# EAGLE design pizerohat (EAGLE 9.5.2)
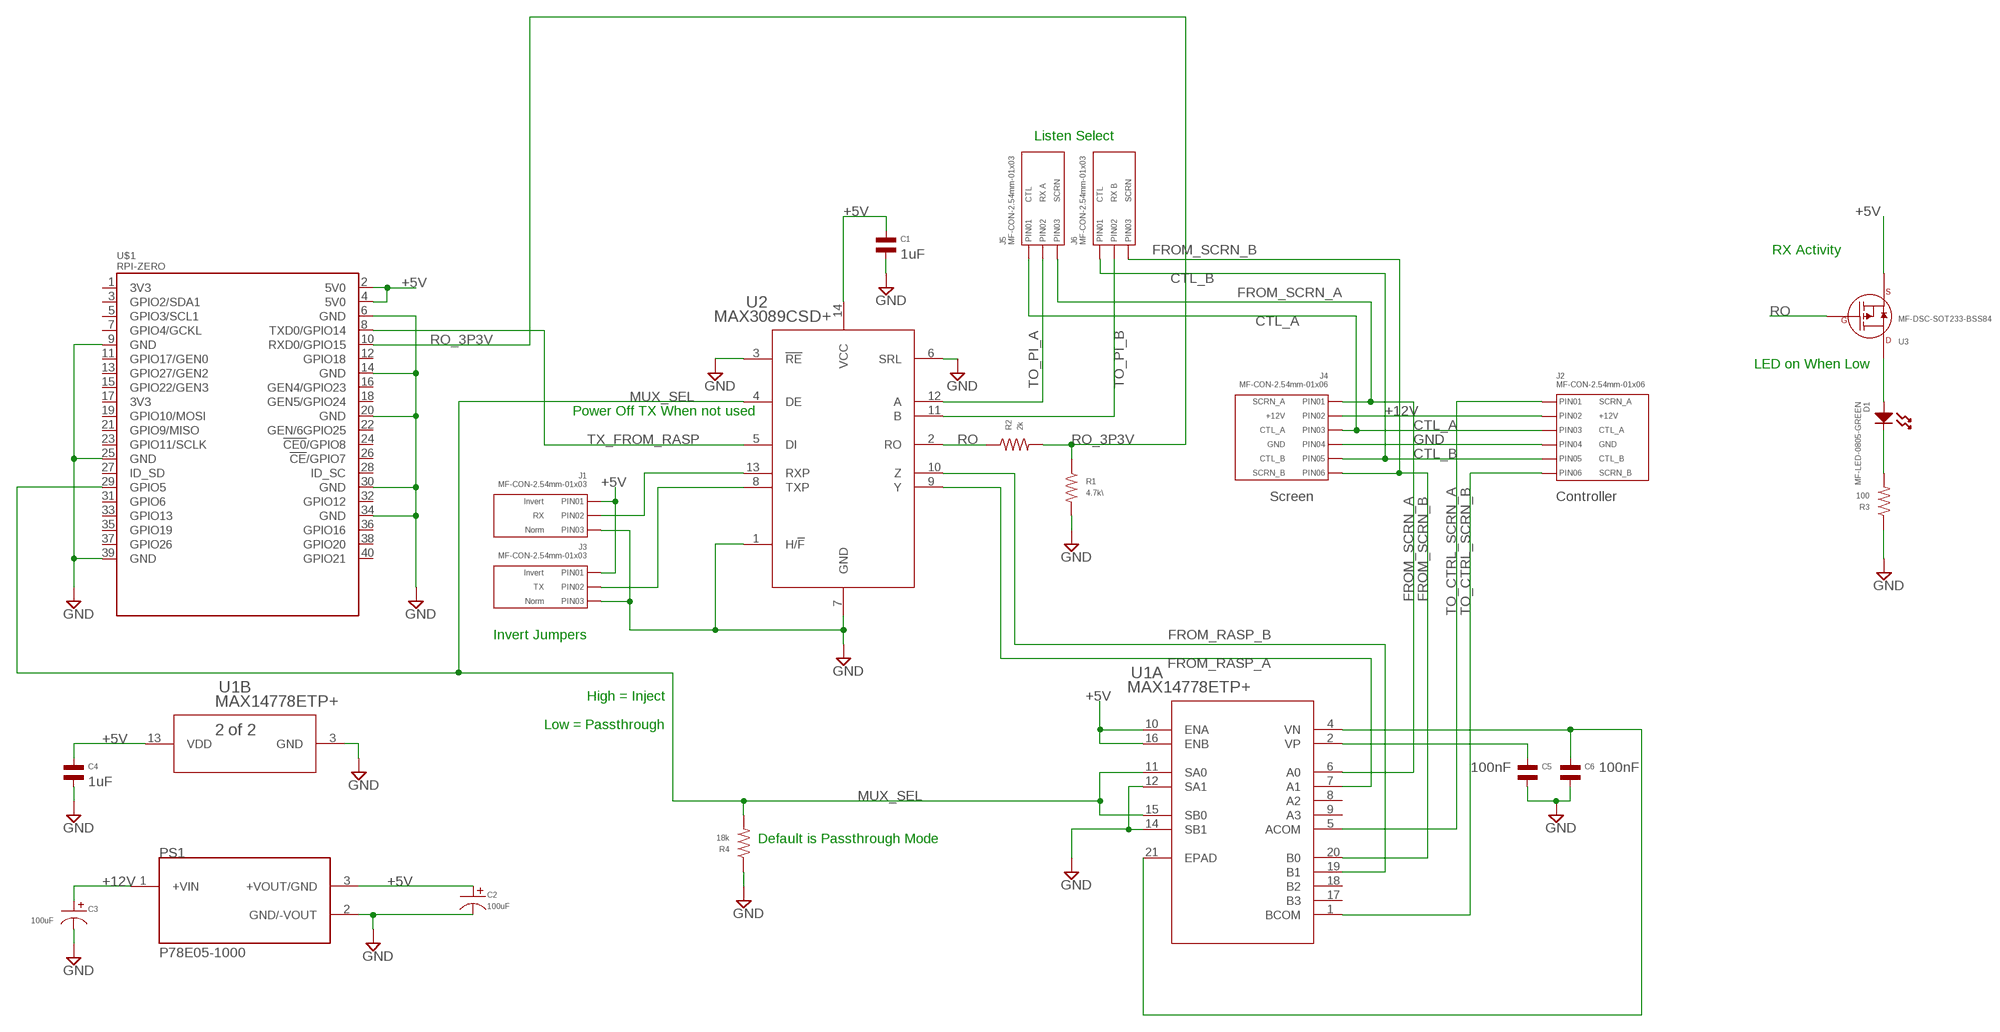
[diagram p0: schematic, sheet 1]

## Parts
C1  CAPACITOR_NP_0603  [C0603]
C2  100uF  CAPACITOR_P_6.3MM  [CP6.3MM]
C3  100uF  CAPACITOR_P_6.3MM  [CP6.3MM]
C4  CAPACITOR_NP_0603  [C0603]
C5  CAPACITOR_NP_0805  [C0805]
C6  CAPACITOR_NP_0805  [C0805]
D1  MF-LED-0805-GREEN  LED_SINGLE-0805-GREEN  [LED0805]
J1  MF-CON-2.54mm-01x03  CON_01X03_PTH_2.54MM  [PTH_2.54MM_01X03]
J2  MF-CON-2.54mm-01x06  CON_01X06_PTH_2.54MM  [PTH_2.54MM_01X06]
J3  MF-CON-2.54mm-01x03  CON_01X03_PTH_2.54MM  [PTH_2.54MM_01X03]
J4  MF-CON-2.54mm-01x06  CON_01X06_PTH_2.54MM  [PTH_2.54MM_01X06]
J5  MF-CON-2.54mm-01x03  CON_01X03_PTH_2.54MM  [PTH_2.54MM_01X03]
J6  MF-CON-2.54mm-01x03  CON_01X03_PTH_2.54MM  [PTH_2.54MM_01X03]
PS1  P78E05-1000  [CONV_P78E05-1000]
R1  4.7k\  RESISTOR_0603  [R0603]
R2  2k  RESISTOR_0603  [R0603]
R3  100  RESISTOR_0603  [R0603]
R4  18k  RESISTOR_0603  [R0603]
U1  MAX14778ETP+  [21-0140L_T2055-4]
U2  MAX3089CSD+  [21-0041B_14]
U3  MF-DSC-SOT233-BSS84  P-CHANNEL_FET_BSS84_SOT-23-3  [SOT-23-3]
U$1  RPI-ZERO  [RASPBERRYPI_BASTELSTUBE_V13_RASPI_BOARD_B+_FULL]

## Nets
+5V: C1.P$1 C2.P$1 C4.P$1 J1.P$1(PIN1) J3.P$1(PIN1) PS1.3(+VOUT/GND) U1.10(A:ENA) U1.13(B:VDD) U1.16(A:ENB) U2.14(VCC) U3.P$2(SOURCE) U$1.2(5V0) U$1.4(5V0)
+12V: C3.P$1 J2.P$2(PIN2) J4.P$2(PIN2) PS1.1(+VIN)
CTL_A: J2.P$3(PIN3) J4.P$3(PIN3) J5.P$1(PIN1)
CTL_B: J2.P$5(PIN5) J4.P$5(PIN5) J6.P$1(PIN1)
FROM_RASP_A: U1.7(A:A1) U2.9(Y)
FROM_RASP_B: U1.19(A:B1) U2.10(Z)
FROM_SCRN_A: J4.P$1(PIN1) J5.P$3(PIN3) U1.6(A:A0)
FROM_SCRN_B: J4.P$6(PIN6) J6.P$3(PIN3) U1.20(A:B0)
GND: C1.P$2 C2.P$2 C3.P$2 C4.P$2 C5.P$2 C6.P$2 J1.P$3(PIN3) J2.P$4(PIN4) J3.P$3(PIN3) J4.P$4(PIN4) PS1.2(GND/-VOUT) R1.P$2 R3.P$1 R4.P$1 U1.3(B:GND) U1.12(A:SA1) U1.14(A:SB1) U2.1(H/!F) U2.3(!RE) U2.6(SRL) U2.7(GND) U$1.6(GND) U$1.9(GND) U$1.14(GND) U$1.20(GND) U$1.25(GND) U$1.30(GND) U$1.34(GND) U$1.39(GND)
MUX_SEL: R4.P$2 U1.11(A:SA0) U1.15(A:SB0) U2.4(DE) U$1.29(GPIO5)
N$3: J1.P$2(PIN2) U2.13(RXP)
N$4: J3.P$2(PIN2) U2.8(TXP)
N$5: C6.P$1 U1.4(A:VN) U1.21(A:EPAD)
N$6: D1.CATHODE R3.P$2
N$7: C5.P$1 U1.2(A:VP)
N$9: D1.ANODE U3.P$3(DRAIN)
RO: R2.P$1 U2.2(RO) U3.P$1(GATE)
RO_3P3V: R1.P$1 R2.P$2 U$1.10(RXD0/GPIO15)
TO_CTRL_SCRN_A: J2.P$1(PIN1) U1.5(A:ACOM)
TO_CTRL_SCRN_B: J2.P$6(PIN6) U1.1(A:BCOM)
TO_PI_A: J5.P$2(PIN2) U2.12(A)
TO_PI_B: J6.P$2(PIN2) U2.11(B)
TX_FROM_RASP: U2.5(DI) U$1.8(TXD0/GPIO14)
Unconnected: U1.8(A:A2) U1.9(A:A3) U1.17(A:B3) U1.18(A:B2) U$1.1(3V3) U$1.3(GPIO2/SDA1) U$1.5(GPIO3/SCL1) U$1.7(GPIO4/GCKL) U$1.11(GPIO17/GEN0) U$1.12(GPIO18) U$1.13(GPIO27/GEN2) U$1.15(GPIO22/GEN3) U$1.16(GEN4/GPIO23) U$1.17(3V3) U$1.18(GEN5/GPIO24) U$1.19(GPIO10/MOSI) U$1.21(GPIO9/MISO) U$1.22(GEN/6GPIO25) U$1.23(GPIO11/SCLK) U$1.24(!CE0!/GPIO8) U$1.26(!CE!/GPIO7) U$1.27(ID_SD) U$1.28(ID_SC) U$1.31(GPIO6) U$1.32(GPIO12) U$1.33(GPIO13) U$1.35(GPIO19) U$1.36(GPIO16) U$1.37(GPIO26) U$1.38(GPIO20) U$1.40(GPIO21)

## Notes on the sheet
- Listen Select
- RX Activity
- LED on When Low
- Power Off TX When not used
- Invert Jumpers
- High = Inject
- Low = Passthrough
- Default is Passthrough Mode

## Library data of the parts
C1 C4 = MF_Passives:CAPACITOR_NP: Library: MF_Passives Description: Device for Non-Polarized Capacitors. Manufacture part number (MPN) can be added via Attributes. Check https://factory.macrofab.com/parts for the house parts list.; CAP: 1uF; HOUSEPART: Y; MPN: MF-CAP-0603-1uF; POPULATE: 1
C2 C3 = MF_Passives:CAPACITOR_P: Library: MF_Passives Description: Device for Polarized Capacitors. Manufacture part number (MPN), Voltage Rating, and Tolerance can be added via Attributes. Check https://factory.macrofab.com/parts for the house parts list.; HOUSEPART: Y; MPN: MF-CAP-6.3MM-100uF; POPULATE: 1
C5 C6 = MF_Passives:CAPACITOR_NP: Library: MF_Passives Description: Device for Non-Polarized Capacitors. Manufacture part number (MPN) can be added via Attributes. Check https://factory.macrofab.com/parts for the house parts list.; CAP: 100nF; HOUSEPART: Y; MPN: MF-CAP-0805-0.1uF; POPULATE: 1
D1 = MF_LEDs:LED_SINGLE: Library: MF_LEDs Description: Device for Single LED Packages. Manufacture part number (MFG#) can be added via Attributes.; HOUSEPART: YES; MPN: MF-LED-0805-GREEN; POPULATE: 1; URL: https://factory.macrofab.com/part/MF-LED-0805-GREEN
J1 = MF_Connectors:CON_01X03: Library: MF_Connectors Description: Header Connector with 03 Positions and 01 Rows. Use the LABEL Attribute to label the pin on the schematic and PCB. You can remove the attributes on the PCB by using the SMASH function on the part and then deleting the text.; HOUSEPART: YES; LABEL01: Invert; LABEL02: RX; LABEL03: Norm; MPN: MF-CON-2.54mm-01x03; POPULATE: 1; URL: https://factory.macrofab.com/part/MF-CON-2.54mm-01x03
J2 = MF_Connectors:CON_01X06: Library: MF_Connectors Description: Header Connector with 6 Positions and 01 Rows. Use the LABEL Attribute to label the pin on the schematic and PCB. You can remove the attributes on the PCB by using the SMASH function on the part and then deleting the text.; HOUSEPART: YES; LABEL: Controller; LABEL01: SCRN_A; LABEL02: +12V; LABEL03: CTL_A; LABEL04: GND; LABEL05: CTL_B; LABEL06: SCRN_B; MPN: MF-CON-2.54mm-01x06; POPULATE: 1; URL: https://factory.macrofab.com/part/MF-CON-2.54mm-01x06
J3 = MF_Connectors:CON_01X03: Library: MF_Connectors Description: Header Connector with 03 Positions and 01 Rows. Use the LABEL Attribute to label the pin on the schematic and PCB. You can remove the attributes on the PCB by using the SMASH function on the part and then deleting the text.; HOUSEPART: YES; LABEL01: Invert; LABEL02: TX; LABEL03: Norm; MPN: MF-CON-2.54mm-01x03; POPULATE: 1; URL: https://factory.macrofab.com/part/MF-CON-2.54mm-01x03
J4 = MF_Connectors:CON_01X06: Library: MF_Connectors Description: Header Connector with 6 Positions and 01 Rows. Use the LABEL Attribute to label the pin on the schematic and PCB. You can remove the attributes on the PCB by using the SMASH function on the part and then deleting the text.; HOUSEPART: YES; LABEL: Screen; LABEL01: SCRN_A; LABEL02: +12V; LABEL03: CTL_A; LABEL04: GND; LABEL05: CTL_B; LABEL06: SCRN_B; MPN: MF-CON-2.54mm-01x06; POPULATE: 1; URL: https://factory.macrofab.com/part/MF-CON-2.54mm-01x06
J5 = MF_Connectors:CON_01X03: Library: MF_Connectors Description: Header Connector with 03 Positions and 01 Rows. Use the LABEL Attribute to label the pin on the schematic and PCB. You can remove the attributes on the PCB by using the SMASH function on the part and then deleting the text.; HOUSEPART: YES; LABEL01: CTL; LABEL02: RX A; LABEL03: SCRN; MPN: MF-CON-2.54mm-01x03; POPULATE: 1; URL: https://factory.macrofab.com/part/MF-CON-2.54mm-01x03
J6 = MF_Connectors:CON_01X03: Library: MF_Connectors Description: Header Connector with 03 Positions and 01 Rows. Use the LABEL Attribute to label the pin on the schematic and PCB. You can remove the attributes on the PCB by using the SMASH function on the part and then deleting the text.; HOUSEPART: YES; LABEL01: CTL; LABEL02: RX B; LABEL03: SCRN; MPN: MF-CON-2.54mm-01x03; POPULATE: 1; URL: https://factory.macrofab.com/part/MF-CON-2.54mm-01x03
PS1 = P78E05-1000:P78E05-1000: NON-ISOLATED DC SWITCHING REGULATOR; CUI_PURCHASE_URL: https://www.cui.com/product/dc-dc-converters/non-isolated/p78e-1000-series?utm_source=snapeda.com&utm_medium=referral&utm_campaign=snapedaBOM; DESCRIPTION: 1 A Output Current, 6~36 Vdc Input, 3 Pin SIP, Non-Isolated, Dc-Dc Converter; DIGI-KEY_PART_NUMBER: 102-5018-ND; DIGI-KEY_PURCHASE_URL: https://www.digikey.com/product-detail/en/cui-inc/P78E05-1000/102-5018-ND/9649654?utm_source=snapeda&utm_medium=aggregator&utm_campaign=symbol; MF: CUI Inc.; MP: P78E05-1000; MPN: P78E05-1000; PACKAGE: SIP-3 CUI Inc.
R1 = MF_Passives:RESISTOR: Library: MF_Passives Description: Device for Resistors. Manufacture part number (MPN), Voltage, Tolerance, and Wattage Rating can be added via Attributes. Check https://factory.macrofab.com/parts for the house parts list.; HOUSEPART: YES; MPN: MF-RES-0603-4.7K; POPULATE: 1
R2 = MF_Passives:RESISTOR: Library: MF_Passives Description: Device for Resistors. Manufacture part number (MPN), Voltage, Tolerance, and Wattage Rating can be added via Attributes. Check https://factory.macrofab.com/parts for the house parts list.; HOUSEPART: YES; MPN: MF-RES-0603-2K; POPULATE: 1
R3 = MF_Passives:RESISTOR: Library: MF_Passives Description: Device for Resistors. Manufacture part number (MPN), Voltage, Tolerance, and Wattage Rating can be added via Attributes. Check https://factory.macrofab.com/parts for the house parts list.; HOUSEPART: YES; MPN: MF-RES-0603-100; POPULATE: 1
R4 = MF_Passives:RESISTOR: Library: MF_Passives Description: Device for Resistors. Manufacture part number (MPN), Voltage, Tolerance, and Wattage Rating can be added via Attributes. Check https://factory.macrofab.com/parts for the house parts list.; HOUSEPART: YES; MPN: MF-RES-0603-18K; POPULATE: 1
U1 = MAX3089:MAX14778ETP+; BUILT_BY: EMA_UL_Team; MANUFACTURER_PART_NUMBER: MAX14778ETP+; MPN: MAX14778ETP+; VENDOR: Maxim Integrated Products
U2 = MAX3089:MAX3089CSD+; BUILT_BY: EMA_UL_Team; MANUFACTURER_PART_NUMBER: MAX3089CSD+; MPN: MAX3089CSD+; VENDOR: Maxim Integrated Products
U3 = MF_Discrete_Semiconductor:P-CHANNEL_FET: Library: MF_Discrete_Semiconductor Description: Device for Single P-Channel Mosfet. Manufacture part number (MFG#) can be added via Attributes.; HOUSEPART: YES; LABEL: RX; MPN: MF-DSC-SOT233-BSS84; POPULATE: 1; URL: https://factory.macrofab.com/part/MF-DSC-SOT233-BSS84
U$1 = RPI-Zero:RPI-ZERO; POPULATE: 0

## Board
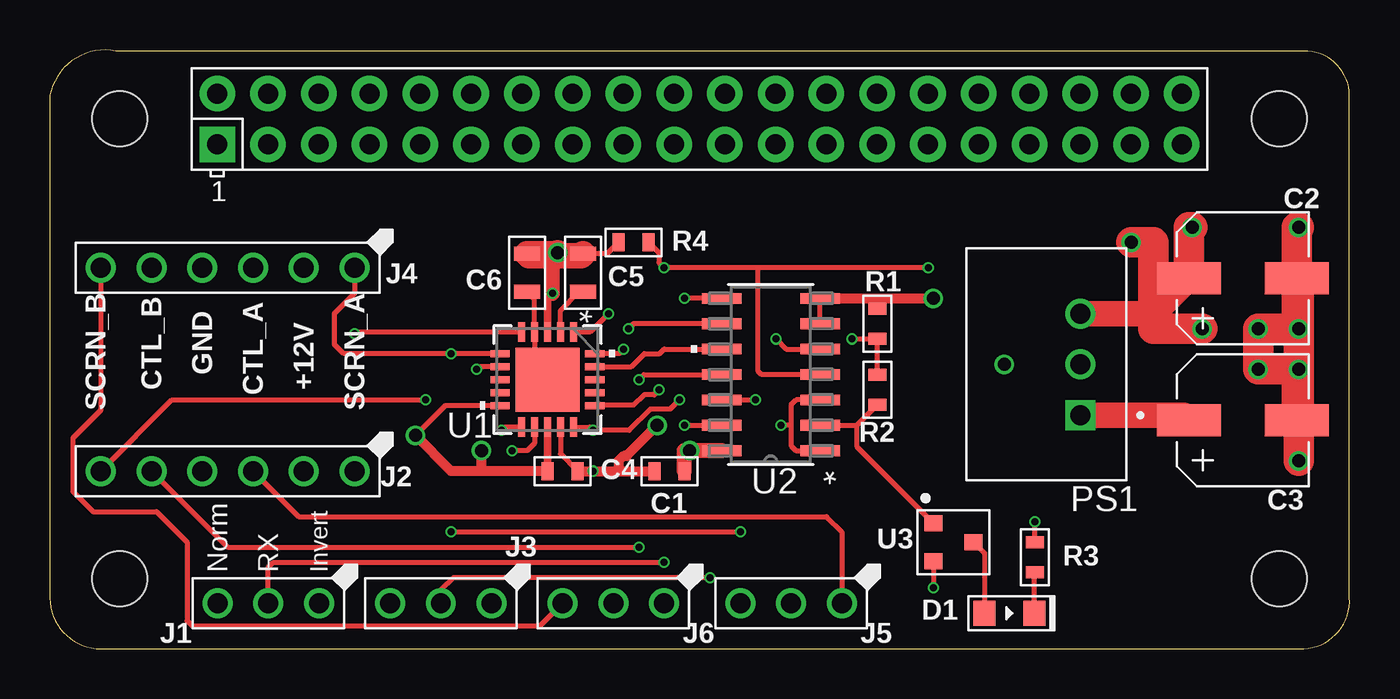
[diagram p1: board, top side]
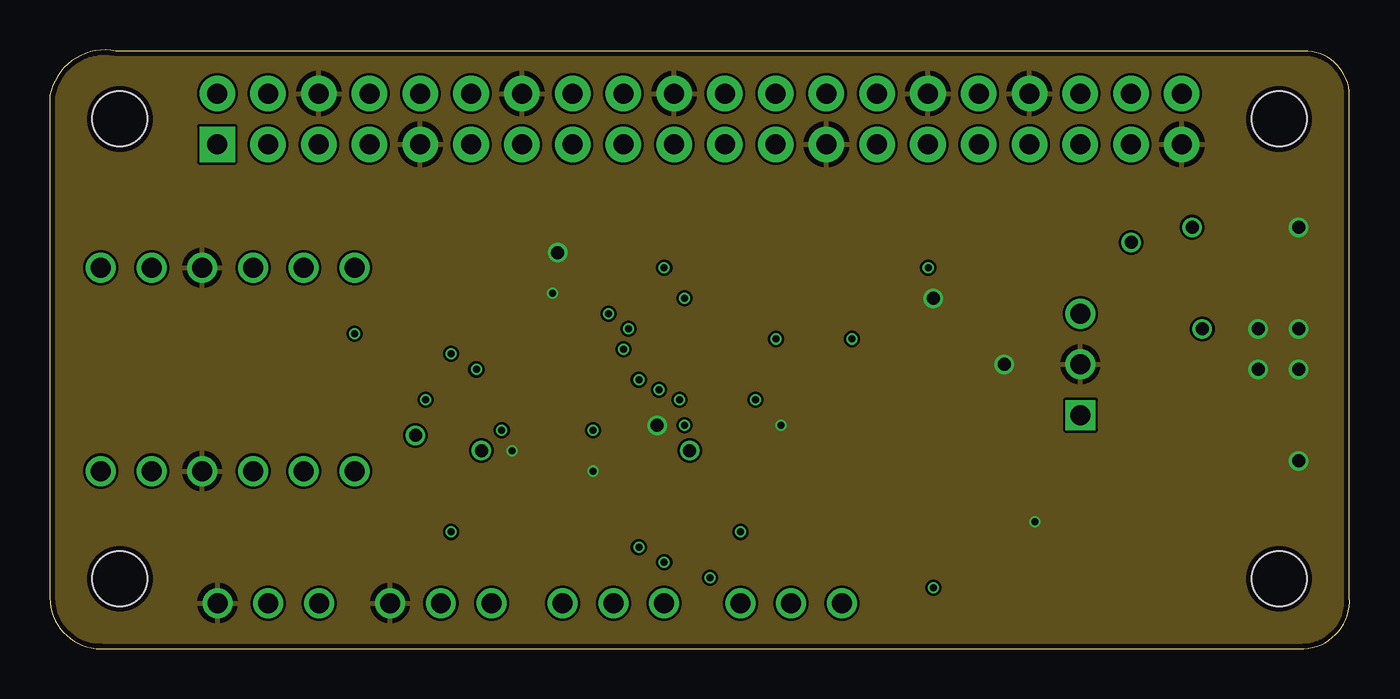
[diagram p2: board, inner layer Route2]
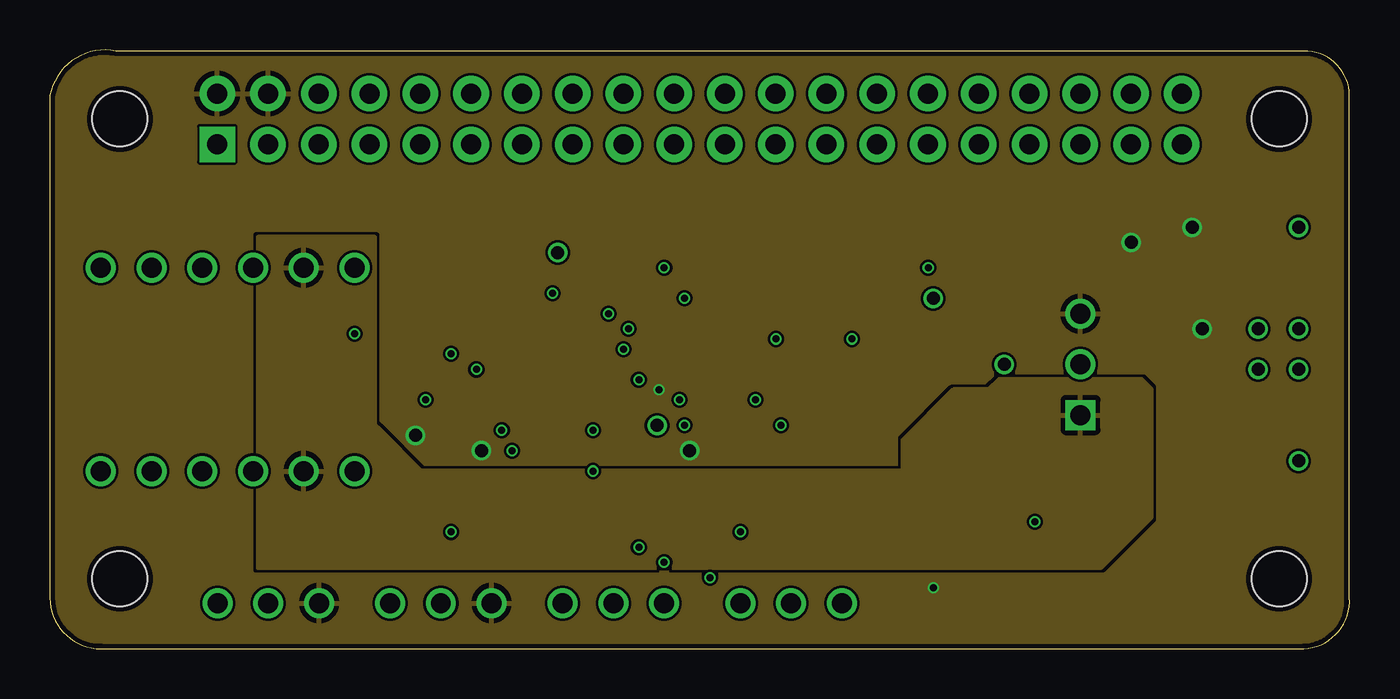
[diagram p3: board, inner layer Route15]
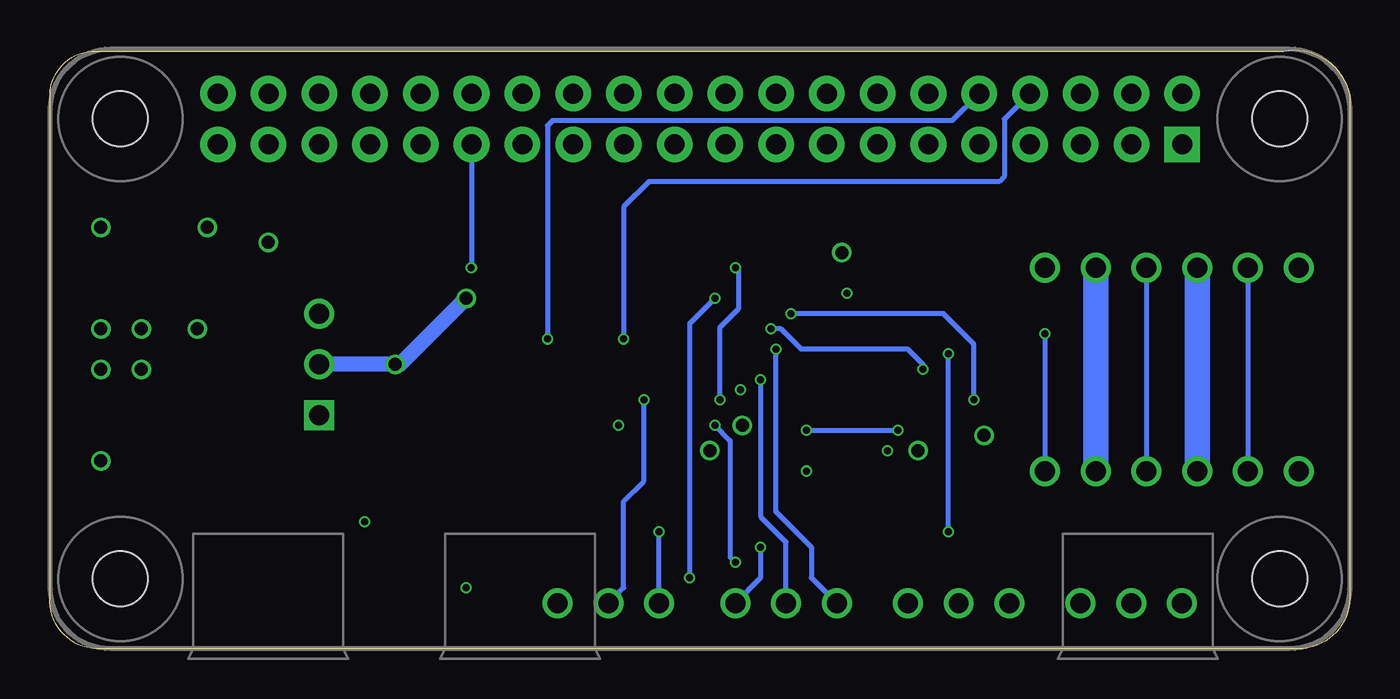
[diagram p4: board, bottom side, seen from below]

Size 65.03 x 29.95 mm. Coordinates in mm from the lower left corner, seen from the top.
Outline: 65.02,2.54 65.02,27.69 arc90 62.74,29.9 3.3,29.9 arc90 0,27.69 0,2.54 arc90 2.54,0 62.74,0 arc90 65.02,2.54
Copper layers (1*2*15*16): Top 0.035mm / dielectric 0.23mm / Route2 0.035mm / dielectric 0.93mm / Route15 0.035mm / dielectric 0.23mm / Bottom 0.035mm
Design rules "MF_Standard_4_Layer": minimum track width 5mil, minimum drill 10mil, track to track 5mil, track to pad 5mil, pad to pad 5mil, via to via 5mil, smd to smd 0mil, copper to edge 10mil, drill to drill 10mil, minimum pad ring 4mil, minimum via ring 4mil, stop-mask expansion 2mil, vias tented up to drill 25mil, thermal gap 10mil

### Footprints (pad centres in the part's own frame; a part is rotated, then mirrored left to right if it is on the bottom)
C0603 = smd 0.6 x 0.9: P$1 -0.75,0; P$2 0.75,0
CP6.3MM = smd 1.6 x 3.2: P$1 0,-2.7; P$2 0,2.7
C0805 = smd 0.7 x 1.3: P$1 -0.95,0; P$2 0.95,0
LED0805 = smd 1.1 x 1.25: ANODE 1.25,0; CATHODE -1.25,0
PTH_2.54MM_01X03 = drill 1: P$1 -2.54,0; P$2 0,0; P$3 2.54,0
PTH_2.54MM_01X06 = drill 1: P$1 -6.35,0; P$2 -3.81,0; P$3 -1.27,0; P$4 1.27,0; P$5 3.81,0; P$6 6.35,0
CONV_P78E05-1000 = drill 1 square: 1 -2.54,0 | drill 1: 2 0,0; 3 2.54,0
R0603 = smd 0.6 x 0.9: P$1 -0.75,0; P$2 0.75,0
21-0140L_T2055-4 = smd 0.965 x 0.356: 1 -2.375,1.3; 2 -2.375,0.65; 3 -2.375,0; 4 -2.375,-0.65; 5 -2.375,-1.3; 11 2.375,-1.3; 12 2.375,-0.65; 13 2.375,0; 14 2.375,0.65; 15 2.375,1.3 | smd 0.356 x 0.965: 6 -1.3,-2.375; 7 -0.65,-2.375; 8 0,-2.375; 9 0.65,-2.375; 10 1.3,-2.375; 16 1.3,2.375; 17 0.65,2.375; 18 0,2.375; 19 -0.65,2.375; 20 -1.3,2.375 | smd 3.2 x 3.2: 21 0,0
21-0041B_14 = smd 1.981 x 0.533: 1 -2.464,3.81; 2 -2.464,2.54; 3 -2.464,1.27; 4 -2.464,0; 5 -2.464,-1.27; 6 -2.464,-2.54; 7 -2.464,-3.81; 8 2.464,-3.81; 9 2.464,-2.54; 10 2.464,-1.27; 11 2.464,0; 12 2.464,1.27; 13 2.464,2.54; 14 2.464,3.81
SOT-23-3 = smd 0.9 x 0.8: P$1 -1,0.95; P$2 -1,-0.95; P$3 1,0
RASPBERRYPI_BASTELSTUBE_V13_RASPI_BOARD_B+_FULL = drill 1 pad 1.778 square: 1 8.37,25.23 | drill 1 pad 1.778: 2 8.37,27.77; 3 10.91,25.23; 4 10.91,27.77; 5 13.45,25.23; 6 13.45,27.77; 7 15.99,25.23; 8 15.99,27.77; 9 18.53,25.23; 10 18.53,27.77; 11 21.07,25.23; 12 21.07,27.77; 13 23.61,25.23; 14 23.61,27.77; 15 26.15,25.23; 16 26.15,27.77; 17 28.69,25.23; 18 28.69,27.77; 19 31.23,25.23; 20 31.23,27.77; 21 33.77,25.23; 22 33.77,27.77; 23 36.31,25.23; 24 36.31,27.77; 25 38.85,25.23; 26 38.85,27.77; 27 41.39,25.23; 28 41.39,27.77; 29 43.93,25.23; 30 43.93,27.77; 31 46.47,25.23; 32 46.47,27.77; 33 49.01,25.23; 34 49.01,27.77; 35 51.55,25.23; 36 51.55,27.77; 37 54.09,25.23; 38 54.09,27.77; 39 56.63,25.23; 40 56.63,27.77 | hole 2.75: 3.5,3.5; 3.5,26.5; 61.5,3.5; 61.5,26.5

### Placement (x,y rotation side)
C1  30.99,8.89 180 top
C2  59.69,18.54 270 top
C3  59.69,11.43 270 top
C4  25.65,8.89 0 top
C5  26.67,18.8 90 top
C6  23.88,18.8 90 top
D1  48.01,1.78 180 top
J1  10.92,2.29 180 top
J2  8.89,8.89 180 top
J3  19.56,2.29 180 top
J4  8.89,19.05 180 top
J5  37.08,2.29 180 top
J6  28.19,2.29 180 top
PS1  51.56,14.22 90 top
R1  41.4,16.26 90 top
R2  41.4,12.95 90 top
R3  49.28,4.57 270 top
R4  29.21,20.32 0 top
U1  24.89,13.46 270 top
U2  36.07,13.72 180 top
U3  45.21,5.33 0 top
U$1  0,0 0 top

### Tracks (layer width: path | path; a pad name or v marks a point on that pad's centre or on a via)
+5V  (via drill 0.35, 0.65)
  Top 0.254: U1.10 19.78,12.16 v18.29,10.67 | U1.16 27.3,12.19 29.21,12.19 29.72,12.7 30.23,12.7 v30.48,12.95 | U3.P$2 44.21,3.06 v44.2,3.05
  Top 0.381: C4.P$1 24.89,8.9 U1.13
  Top 0.508: C4.P$1 21.59,8.89 | 21.59,8.89 20.07,8.89 v18.29,10.67 | 21.59,8.89 v21.59,9.91
  Top 0.762: U2.14 v32,9.91 31.74,9.91 C1.P$1
  Top 1.27: C2.P$1 55.21,16.76 PS1.3
  Top 1.524: C2.P$1 56.99,21.08 v57.15,21.08 | v54.1,20.32 55.21,20.32 55.21,16.76 55.21,16 v57.66,16
  pour Route15 (rank 2): 0,0 0,29.97 65.28,29.97 65.28,-0.25 0.25,-0.25
+12V
  Top 1.27: PS1.1 56.74,11.68 C3.P$1
  Bottom 1.27: J2.P$2 J4.P$2
  pour Route15: 10.41,20.57 10.41,4.06 52.58,4.06 55.12,6.6 55.12,10.41 55.12,12.95 54.61,13.46 47.5,13.46 46.99,12.95 45.21,12.95 42.67,10.41 42.67,8.89 18.54,8.89 16.51,10.92 16.26,11.18 16.26,20.32 16.26,20.57
CTL_A
  Top 0.254: J5.P$1 39.62,5.84 38.86,6.6 12.45,6.6 J2.P$3
  Bottom 0.254: J4.P$3 J2.P$3
CTL_B  (via drill 0.35)
  Top 0.254: J2.P$5 8.89,5.08 v29.46,5.08
  Bottom 0.254: J6.P$1 29.46,3.56 v29.46,5.08 | J4.P$5 J2.P$5
FROM_RASP_A  (via drill 0.35)
  Top 0.254: v28.96,16 29.21,16.26 U2.9 | U1.7 21.48,14.11 v21.34,13.97
  Bottom 0.254: v28.96,16 28.45,16 27.43,14.99 22.1,14.99 21.34,14.22 v21.34,13.97
FROM_RASP_B
  Top 0.254: U2.10 30.73,14.99 30.51,14.76 29.75,14.76 29.1,14.11 U1.19
FROM_SCRN_A  (via drill 0.35)
  Top 0.254: J4.P$1 15.24,17.78 14.22,16.76 14.22,15.24 14.7,14.76 v20.07,14.76 U1.6 | v20.07,5.84 v34.54,5.84
  Bottom 0.254: J5.P$3 v34.54,5.84 | v20.07,5.84 v20.07,14.76
FROM_SCRN_B  (via drill 0.35)
  Top 0.254: J6.P$3 24.51,1.14 7.11,1.14 6.86,1.4 6.86,5.33 5.33,6.86 2.16,6.86 1.14,7.87 1.14,10.54 2.54,11.94 J4.P$6 | v28.7,14.99 28.48,14.76 U1.20
  Bottom 0.254: J6.P$3 26.92,3.56 26.92,5.08 28.7,6.86 v28.7,14.99
GND  (via drill 0.35, 0.65)
  Top 0.254: C6.P$2 23.97,19.65 | R1.P$2 41.4,17.53 | U2.6 U2.7 | C4.P$2 25.54,9.75 U1.14 | U1.12 24.24,10.27 23.88,9.91 v23.11,9.91 | U2.3 37.34,12.45 37.08,12.19 37.08,11.18 | 37.08,11.18 37.08,10.16 37.34,9.91 U2.1 | 37.08,11.18 v36.58,11.18 | R3.P$1 v49.28,6.35 | R4.P$1 27.89,19.75 C5.P$2
  Top 0.381: v25.15,17.78 24.89,17.53 U1.3
  Top 0.508: U2.7 41.4,17.53 v44.2,17.53 | C4.P$2 v27.18,8.89 28.45,8.89 | 28.45,8.89 C1.P$2 | v30.38,11.18 28.85,9.65 28.7,9.65 28.45,9.4 28.45,8.89
  Top 0.762: v25.15,17.78 25.15,19.65
  Top 1.27: C5.P$2 26.58,19.65 25.15,19.65 23.97,19.65 | v25.4,19.81 25.33,19.75 C6.P$2
  Top 1.524: C2.P$2 62.39,21.08 v62.48,21.08 | 62.48,11.43 v62.48,13.97 v62.48,16 62.48,18.54 C2.P$2 | 62.48,11.43 C3.P$2 62.39,13.97 v60.45,13.97 v60.45,16 62.39,16 C2.P$2 | 62.48,11.43 v62.48,9.4
  Bottom 0.762: v44.2,17.53 47.5,14.22 PS1.2
  Bottom 1.27: J2.P$4 J4.P$4
  other vias: 47.75,14.22
  pour Route2: 0,0 0,29.97 65.02,29.97 65.02,0.25 65.02,-0.25 0.25,-0.25
MUX_SEL  (via drill 0.35)
  Top 0.254: U1.11 22.77,11.09 v22.61,10.92 | v43.94,19.05 35.43,19.05 | 35.43,19.05 v30.73,19.05 30.47,19.32 30.47,19.81 R4.P$2 | U1.15 27.01,11.09 v27.18,10.92 28.98,10.92 30.04,11.98 31.03,11.98 v31.5,12.45 | U2.4 35.6,13.72 35.43,13.88 35.43,19.05
  Bottom 0.254: U$1.29 43.93,19.06 v43.94,19.05 | v27.18,10.92 v22.61,10.92 | v30.73,19.05 30.58,18.9 30.58,17 31.5,16.09 v31.5,12.45
N$3  (via drill 0.35)
  Top 0.254: v31.75,11.18 U2.13 | J1.P$2 10.92,4.06 11.18,4.32 v30.73,4.32
  Bottom 0.254: v30.73,4.32 30.99,4.57 30.99,10.41 v31.75,11.18
N$4  (via drill 0.35)
  Top 0.254: U2.8 v31.75,17.53 | v33.02,3.56 20.19,3.56 19.56,2.92 J3.P$2
  Bottom 0.254: v33.02,3.56 33.02,16.26 v31.75,17.53
N$5
  Top 0.254: C6.P$1 24.24,17.48 U1.4 24.24,14.11 U1.21
N$6
  Top 0.254: D1.CATHODE 49.26,3.8 R3.P$2
N$7
  Top 0.254: U1.2 25.54,16.91 26.48,17.85 C5.P$1
N$9
  Top 0.254: U3.P$3 46.76,4.79 D1.ANODE
RO
  Top 0.254: U2.2 40.39,11.18 | 40.39,11.18 R2.P$1 | U3.P$1 40.39,10.11 40.39,11.18
RO_3P3V  (via drill 0.35)
  Top 0.254: R2.P$2 R1.P$1 41.39,15.49 v40.13,15.49
  Bottom 0.254: U$1.10 19.88,26.42 39.88,26.42 40.13,26.16 v40.13,15.49
TO_CTRL_SCRN_A  (via drill 0.35)
  Top 0.254: U1.5 15.33,15.84 v15.24,15.75
  Bottom 0.254: v15.24,15.75 J2.P$1
TO_CTRL_SCRN_B  (via drill 0.35)
  Top 0.254: J2.P$6 6.1,12.45 v18.8,12.45 | v27.94,16.76 27.01,15.84 U1.1
  Bottom 0.254: v27.94,16.76 20.32,16.76 18.8,15.24 v18.8,12.45
TO_PI_A  (via drill 0.35)
  Top 0.254: U2.12 v35.31,12.45
  Bottom 0.254: J5.P$2 36.32,3.05 36.32,7.37 35.31,8.38 v35.31,12.45
TO_PI_B  (via drill 0.35)
  Top 0.254: v29.46,13.46 29.72,13.72 U2.11
  Bottom 0.254: J6.P$2 28.19,5.33 29.46,6.6 v29.46,13.46
TX_FROM_RASP  (via drill 0.35)
  Top 0.254: v36.32,15.49 36.83,14.99 U2.5
  Bottom 0.254: U$1.8 17.27,26.49 17.27,23.62 17.53,23.37 35.05,23.37 36.32,22.1 v36.32,15.49

### Text on the board
tValues: Spa Control v1 Jeremy Rode 2019
tDocu: Spa Control v1 | Spa Control v1